# EAGLE design Buttons (EAGLE 8.5.2)
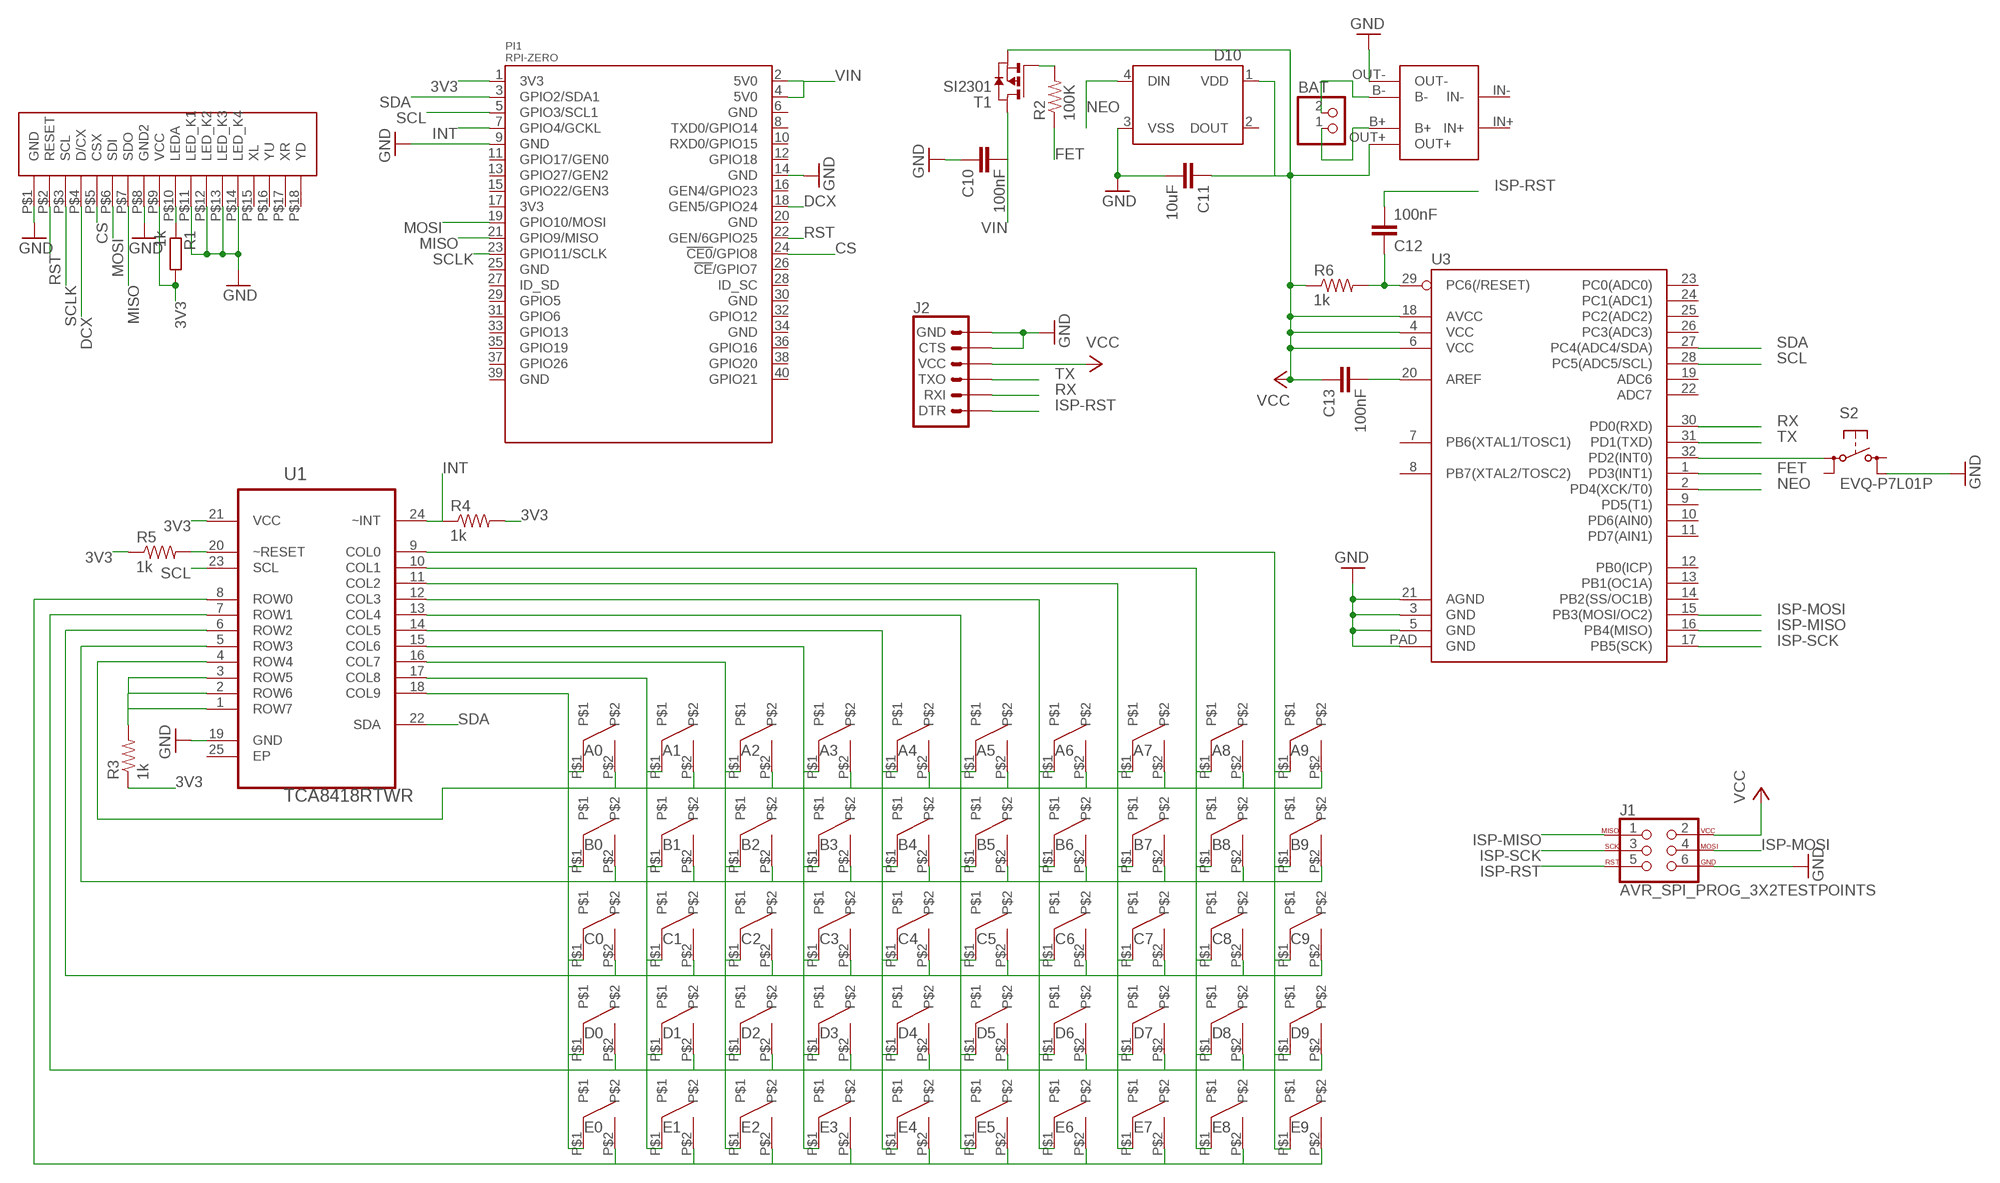
[diagram p0: schematic, sheet 1]

## Parts
A0  5MMSNAP  [5MMSNAP]
A1  5MMSNAP  [5MMSNAP]
A2  5MMSNAP  [5MMSNAP]
A3  5MMSNAP  [5MMSNAP]
A4  5MMSNAP  [5MMSNAP]
A5  5MMSNAP  [5MMSNAP]
A6  5MMSNAP  [5MMSNAP]
A7  5MMSNAP  [5MMSNAP]
A8  5MMSNAP  [5MMSNAP]
A9  5MMSNAP  [5MMSNAP]
B0  5MMSNAP  [5MMSNAP]
B1  5MMSNAP  [5MMSNAP]
B2  5MMSNAP  [5MMSNAP]
B3  5MMSNAP  [5MMSNAP]
B4  5MMSNAP  [5MMSNAP]
B5  5MMSNAP  [5MMSNAP]
B6  5MMSNAP  [5MMSNAP]
B7  5MMSNAP  [5MMSNAP]
B8  5MMSNAP  [5MMSNAP]
B9  5MMSNAP  [5MMSNAP]
BAT  JST_2PIN-SMT-RA  [JST-PH-2-SMT-RA]
C0  5MMSNAP  [5MMSNAP]
C1  5MMSNAP  [5MMSNAP]
C2  5MMSNAP  [5MMSNAP]
C3  5MMSNAP  [5MMSNAP]
C4  5MMSNAP  [5MMSNAP]
C5  5MMSNAP  [5MMSNAP]
C6  5MMSNAP  [5MMSNAP]
C7  5MMSNAP  [5MMSNAP]
C8  5MMSNAP  [5MMSNAP]
C9  5MMSNAP  [5MMSNAP]
C10  100nF  C-EUC0603K  [C0603K]
C11  10uF  C-EUC0603K  [C0603K]
C12  100nF  C-EUC0603K  [C0603K]
C13  100nF  C-EUC0603K  [C0603K]
D0  5MMSNAP  [5MMSNAP]
D1  5MMSNAP  [5MMSNAP]
D2  5MMSNAP  [5MMSNAP]
D3  5MMSNAP  [5MMSNAP]
D4  5MMSNAP  [5MMSNAP]
D5  5MMSNAP  [5MMSNAP]
D6  5MMSNAP  [5MMSNAP]
D7  5MMSNAP  [5MMSNAP]
D8  5MMSNAP  [5MMSNAP]
D9  5MMSNAP  [5MMSNAP]
D10  WS2812B  [WS2812B]
E0  5MMSNAP  [5MMSNAP]
E1  5MMSNAP  [5MMSNAP]
E2  5MMSNAP  [5MMSNAP]
E3  5MMSNAP  [5MMSNAP]
E4  5MMSNAP  [5MMSNAP]
E5  5MMSNAP  [5MMSNAP]
E6  5MMSNAP  [5MMSNAP]
E7  5MMSNAP  [5MMSNAP]
E8  5MMSNAP  [5MMSNAP]
E9  5MMSNAP  [5MMSNAP]
J1  AVR_SPI_PROG_3X2TESTPOINTS  [2X3_TEST_POINTS]
J2  6_PIN_SERIAL_TARGETSILK  [6_PIN_SERIAL_TARGET_SIDE_W_SILK]
PI1  RPI-ZERO  [RASPBERRYPI_BASTELSTUBE_V13_RASPI_BOARD_B+_FULL]
R1  1k  R-EU_R0805  [R0805]
R2  100K  RESISTOR0603-RES  [0603-RES]
R3  1k  RESISTOR0805-RES  [0805]
R4  1k  RESISTOR0805-RES  [0805]
R5  1k  RESISTOR0805-RES  [0805]
R6  1k  RESISTOR0805-RES  [0805]
S2  EVQ-P7L01P  [EVQ-P7L01P]
T1  SI2301  PMOSSOT23  [SOT-23]
U1  TCA8418RTWR  [QFN50P400X400X80-25N]
U3  ATMEGA328P_MLFMLF32  [MLF32-PAD]
U$1  03962A  [03962A]
U$2  ILI9341-2.8  [ILI9341-2.8]

## Nets
3V3: PI1.1(3V3) R1.2 R3.1 R4.2 R5.1 U1.21(VCC) U$2.P$9(VCC)
CS: PI1.24(!CE0!/GPIO8) U$2.P$5(CSX)
DCX: PI1.18(GEN5/GPIO24) U$2.P$4(D/CX)
FET: R2.1 U3.1(PD3(INT1))
GND: C10.1 C11.2 D10.3(VSS) J1.6 J2.P$5(CTS) J2.P$6(GND) PI1.9(GND) PI1.14(GND) S2.B1(S1) U1.19(GND) U3.3(GND) U3.5(GND) U3.21(AGND) U3.PAD(GND) U$1.OUT- U$2.P$1(GND) U$2.P$8(GND2) U$2.P$11(LED_K1) U$2.P$12(LED_K2) U$2.P$13(LED_K3) U$2.P$14(LED_K4)
INT: PI1.7(GPIO4/GCKL) R4.1 U1.24(~INT)
ISP-MISO: J1.1 U3.16(PB4(MISO))
ISP-MOSI: J1.4 U3.15(PB3(MOSI/OC2))
ISP-RST: C12.2 J1.5 J2.P$1(DTR)
ISP-SCK: J1.3 U3.17(PB5(SCK))
MISO: PI1.21(GPIO9/MISO) U$2.P$7(SDO)
MOSI: PI1.19(GPIO10/MOSI) U$2.P$6(SDI)
N$1: S2.A(P) U3.32(PD2(INT0))
N$3: C13.2 U3.20(AREF)
N$4: C12.1 R6.2 U3.29(PC6(/RESET))
N$5: R1.1 U$2.P$10(LEDA)
N$8: R3.2 U1.1(ROW7) U1.2(ROW6) U1.3(ROW5)
N$10: R2.2 T1.3(G)
N$16: R5.2 U1.20(~RESET)
N$23: A9.P$1 B9.P$1 C9.P$1 D9.P$1 E9.P$1 U1.9(COL0)
N$24: A0.P$2 A1.P$2 A2.P$2 A3.P$2 A4.P$2 A5.P$2 A6.P$2 A7.P$2 A8.P$2 A9.P$2 U1.4(ROW4)
N$29: B0.P$2 B1.P$2 B2.P$2 B3.P$2 B4.P$2 B5.P$2 B6.P$2 B7.P$2 B8.P$2 B9.P$2 U1.5(ROW3)
N$30: C0.P$2 C1.P$2 C2.P$2 C3.P$2 C4.P$2 C5.P$2 C6.P$2 C7.P$2 C8.P$2 C9.P$2 U1.6(ROW2)
N$31: D0.P$2 D1.P$2 D2.P$2 D3.P$2 D4.P$2 D5.P$2 D6.P$2 D7.P$2 D8.P$2 D9.P$2 U1.7(ROW1)
N$33: E0.P$2 E1.P$2 E2.P$2 E3.P$2 E4.P$2 E5.P$2 E6.P$2 E7.P$2 E8.P$2 E9.P$2 U1.8(ROW0)
N$36: BAT.1 U$1.B+
N$37: BAT.2 U$1.B-
N$38: A0.P$1 B0.P$1 C0.P$1 D0.P$1 E0.P$1 U1.18(COL9)
N$39: A1.P$1 B1.P$1 C1.P$1 D1.P$1 E1.P$1 U1.17(COL8)
N$40: A2.P$1 B2.P$1 C2.P$1 D2.P$1 E2.P$1 U1.16(COL7)
N$41: A3.P$1 B3.P$1 C3.P$1 D3.P$1 E3.P$1 U1.15(COL6)
N$42: A4.P$1 B4.P$1 C4.P$1 D4.P$1 E4.P$1 U1.14(COL5)
N$43: A5.P$1 B5.P$1 C5.P$1 D5.P$1 E5.P$1 U1.13(COL4)
N$44: A6.P$1 B6.P$1 C6.P$1 D6.P$1 E6.P$1 U1.12(COL3)
N$45: A7.P$1 B7.P$1 C7.P$1 D7.P$1 E7.P$1 U1.11(COL2)
N$46: A8.P$1 B8.P$1 C8.P$1 D8.P$1 E8.P$1 U1.10(COL1)
NEO: D10.4(DIN) U3.2(PD4(XCK/T0))
RST: PI1.22(GEN/6GPIO25) U$2.P$2(RESET)
RX: J2.P$3(RXI) U3.30(PD0(RXD))
SCL: PI1.5(GPIO3/SCL1) U1.23(SCL) U3.28(PC5(ADC5/SCL))
SCLK: PI1.23(GPIO11/SCLK) U$2.P$3(SCL)
SDA: PI1.3(GPIO2/SDA1) U1.22(SDA) U3.27(PC4(ADC4/SDA))
TX: J2.P$2(TXO) U3.31(PD1(TXD))
VCC [Power]: C11.1 C13.1 D10.1(VDD) J1.2 J2.P$4(VCC) R6.1 T1.2(S) U3.4(VCC) U3.6(VCC) U3.18(AVCC) U$1.OUT+
VIN: C10.2 PI1.2(5V0) PI1.4(5V0) T1.1(D)
Unconnected: D10.2(DOUT) PI1.6(GND) PI1.8(TXD0/GPIO14) PI1.10(RXD0/GPIO15) PI1.11(GPIO17/GEN0) PI1.12(GPIO18) PI1.13(GPIO27/GEN2) PI1.15(GPIO22/GEN3) PI1.16(GEN4/GPIO23) PI1.17(3V3) PI1.20(GND) PI1.25(GND) PI1.26(!CE!/GPIO7) PI1.27(ID_SD) PI1.28(ID_SC) PI1.29(GPIO5) PI1.30(GND) PI1.31(GPIO6) PI1.32(GPIO12) PI1.33(GPIO13) PI1.34(GND) PI1.35(GPIO19) PI1.36(GPIO16) PI1.37(GPIO26) PI1.38(GPIO20) PI1.39(GND) PI1.40(GPIO21) S2.A1(P1) S2.B(S) U1.25(EP) U3.7(PB6(XTAL1/TOSC1)) U3.8(PB7(XTAL2/TOSC2)) U3.9(PD5(T1)) U3.10(PD6(AIN0)) U3.11(PD7(AIN1)) U3.12(PB0(ICP)) U3.13(PB1(OC1A)) U3.14(PB2(SS/OC1B)) U3.19(ADC6) U3.22(ADC7) U3.23(PC0(ADC0)) U3.24(PC1(ADC1)) U3.25(PC2(ADC2)) U3.26(PC3(ADC3)) U$1.IN+ U$1.IN- U$2.P$15(XL) U$2.P$16(YU) U$2.P$17(XR) U$2.P$18(YD)

## Library data of the parts
A0 A1-A9 B0 B1-B9 C0 C1-C9 D0 D1-D9 E0 E1-E9 = 5mmSNAP:5MMSNAP
BAT = adafruit:JST_2PIN: JST 2-Pin Connectors of various flavors SMT-RA (S2B-PH-SM4) 4UConnector #17311 SMT (B2B-PH-SM4) THM-RA (S2B-PH) THM (B2B-PH)
C10 C12 C13 = rcl:C-EU: CAPACITOR, European symbol
C11 = resistor:C-EU: CAPACITOR, European symbol
D10 = SparkFun-LED:WS2812B: WS2812B - Intelligent control LED integrated light source Technical Specifications: Power Supply Voltage (VDD): 3.5 to 5.3 V Input Voltage (VI): -0.5 to VDD+0.5 V Operating Junction Temperature (Topt): -25°C to +80°C Storage Temperature Range (Tstg): -55°C to +150°C; PROD_ID: DIO-12503
J1 = SparkFun-Connectors:AVR_SPI_PROG_3X2: AVR ISP 6 Pin This is the reduced ISP connector for AVR programming. Common on Arduino. This footprint will take up less PCB space and can be used with a 10-pin to 6-pin adapter such as SKU: BOB-08508 **Special note about "TEST_POINT" package. The stop mask is on the top side, so if you want your programming test points to be on the bottom of your board, make sure to place this package on the bottom side of the board. This also ensure that the orientation to program from the bottom side will be correct. SparkFun Products: SparkFun ISP Pogo Adapter <https://www.sparkfun.com/products/11591> - NS Tiny AVR Programmer <https://www.sparkfun.com/products/11801> -PTH
J2 = SparkFun-Connectors:6_PIN_SERIAL_TARGET: 6-pin header connection for use with the "FTDI BASIC" pinout - TARGET SIDE. Also known as "Arduino Serial Program Header". It is used to mate with our FTDI Basic serial programmers using the Arduino IDE. Note, this device has "TARGET" in the name. It is intended to be used on a design that contains a target micro-controller that you wish to program. The "sister" device, named "CABLE" is inteneded to be used on a design that usually lives on the end of your USB cable and prvides the converter chip (FTDI232 or FTDI231x) to commnicate serial RX/TX. You can populate with some of these: Break Away Headers - Straight <https://www.sparkfun.com/products/116> (PRT-00116) For reference (or to suit your programming needs) check out these designs: SparkFun FTDI Basic Breakout - 5V <https://www.sparkfun.com/products/9716> (DEV-09716) SparkFun FTDI Basic Breakout - 3.3V <https://www.sparkfun.com/products/9873> (DEV-09873) SparkFun FTDI SmartBasic <https://www.sparkfun.com/products/12935> (DEV-12935) SparkFun Beefy 3 - FTDI Basic Breakout <https://www.sparkfun.com/products/13746> (DEV-13746)
PI1 = RPI-Zero:RPI-ZERO
R1 = resistor:R-EU_: RESISTOR, European symbol
R2-R6 = SparkFun-Passives:RESISTOR: Resistor Basic schematic elements and footprints for 0603, 1206, and PTH resistors.
S2 = switch-panasonic:EVQ-P7L01P: SMD Tactile Switch
T1 = zetex:PMOSSOT23: MOS FET; OC_FARNELL: unknown; OC_NEWARK: unknown
U1 = Texas Instruments_By_element14_Batch_1:TCA8418RTWR: I2C CONTROLLED KEYPAD SCAN IC; MPN: TCA8418RTWR; OC_FARNELL: -; OC_NEWARK: 50R7921; PACKAGE: QFN-24; SUPPLIER: Texas Instruments
U3 = SparkFun-IC-Microcontroller:ATMEGA328P_MLF: Datasheet SparkFun Products () () 32-Pin Atmega328 part Commonly used on Arduino compatible boards Available in QFP and QFN packages TQFP is IC-09069 QFN is non-stock
U$1 = 03962A:03962A
U$2 = ili9341:ILI9341-2.8

## Net classes
0 default: width 0.254 mm, drill 0.356 mm, clearance 0.254 mm
1 Power: width 0.406 mm, drill 0.356 mm, clearance 0.305 mm

## Board
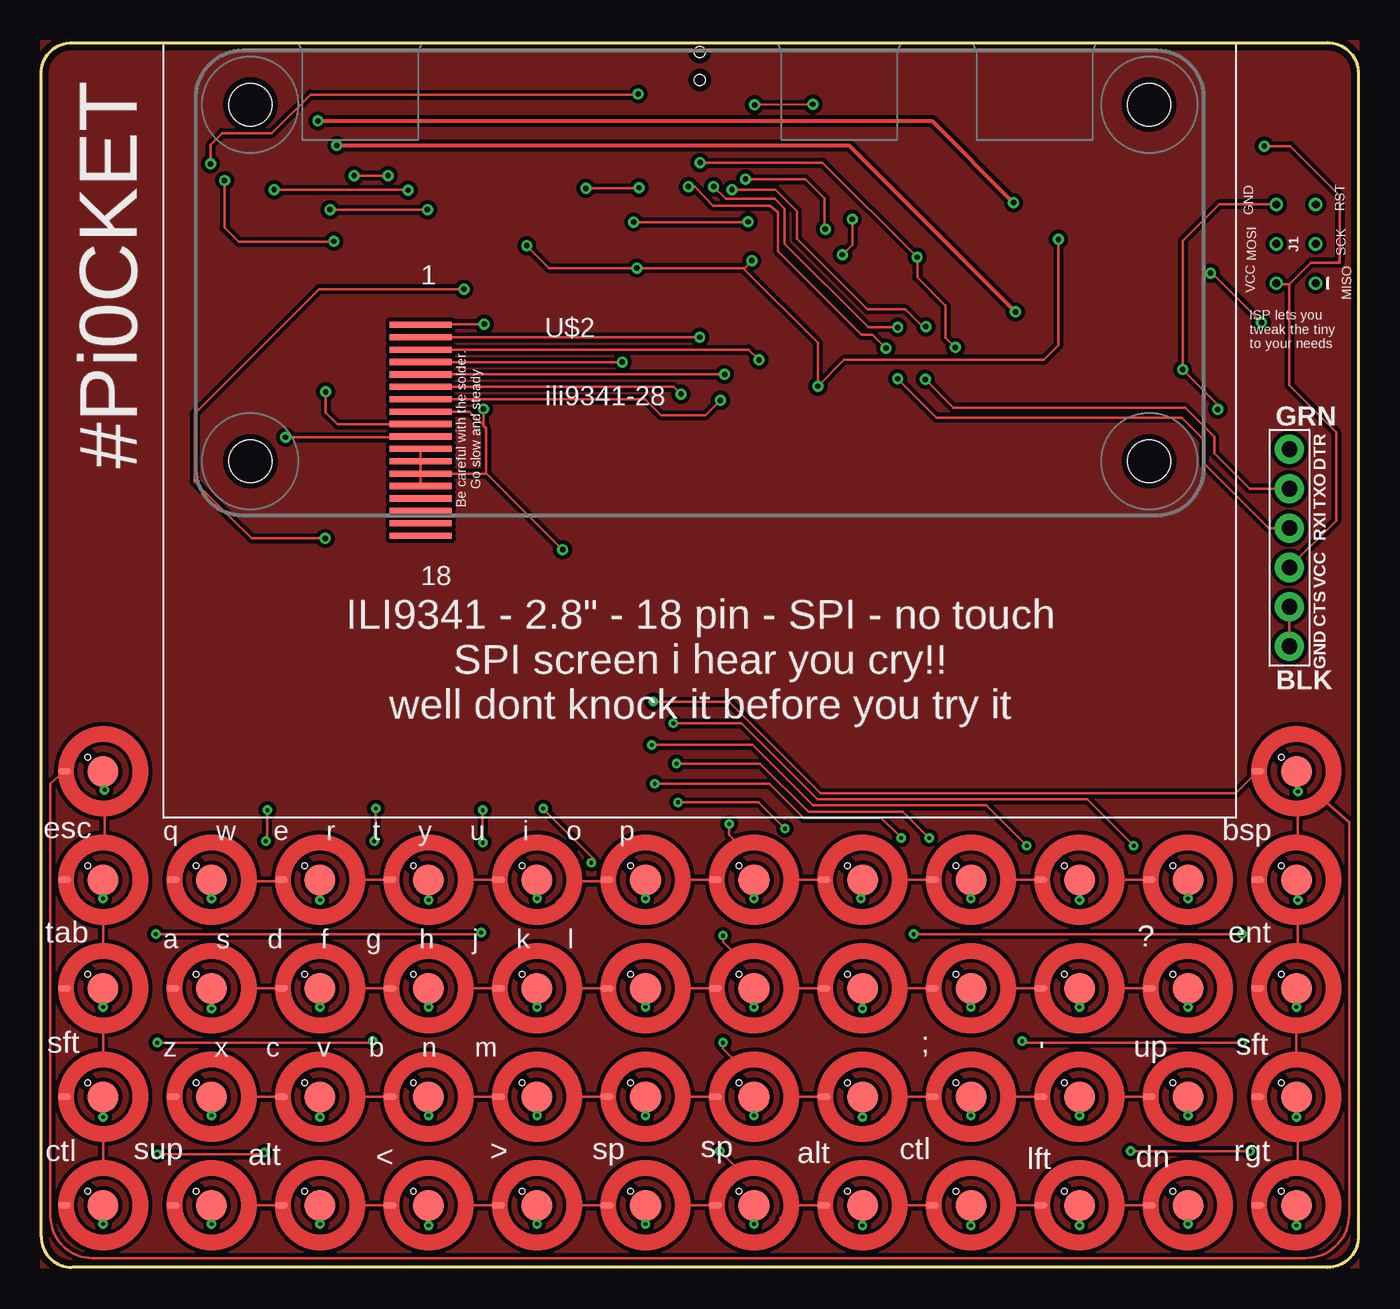
[diagram p1: board, top side]
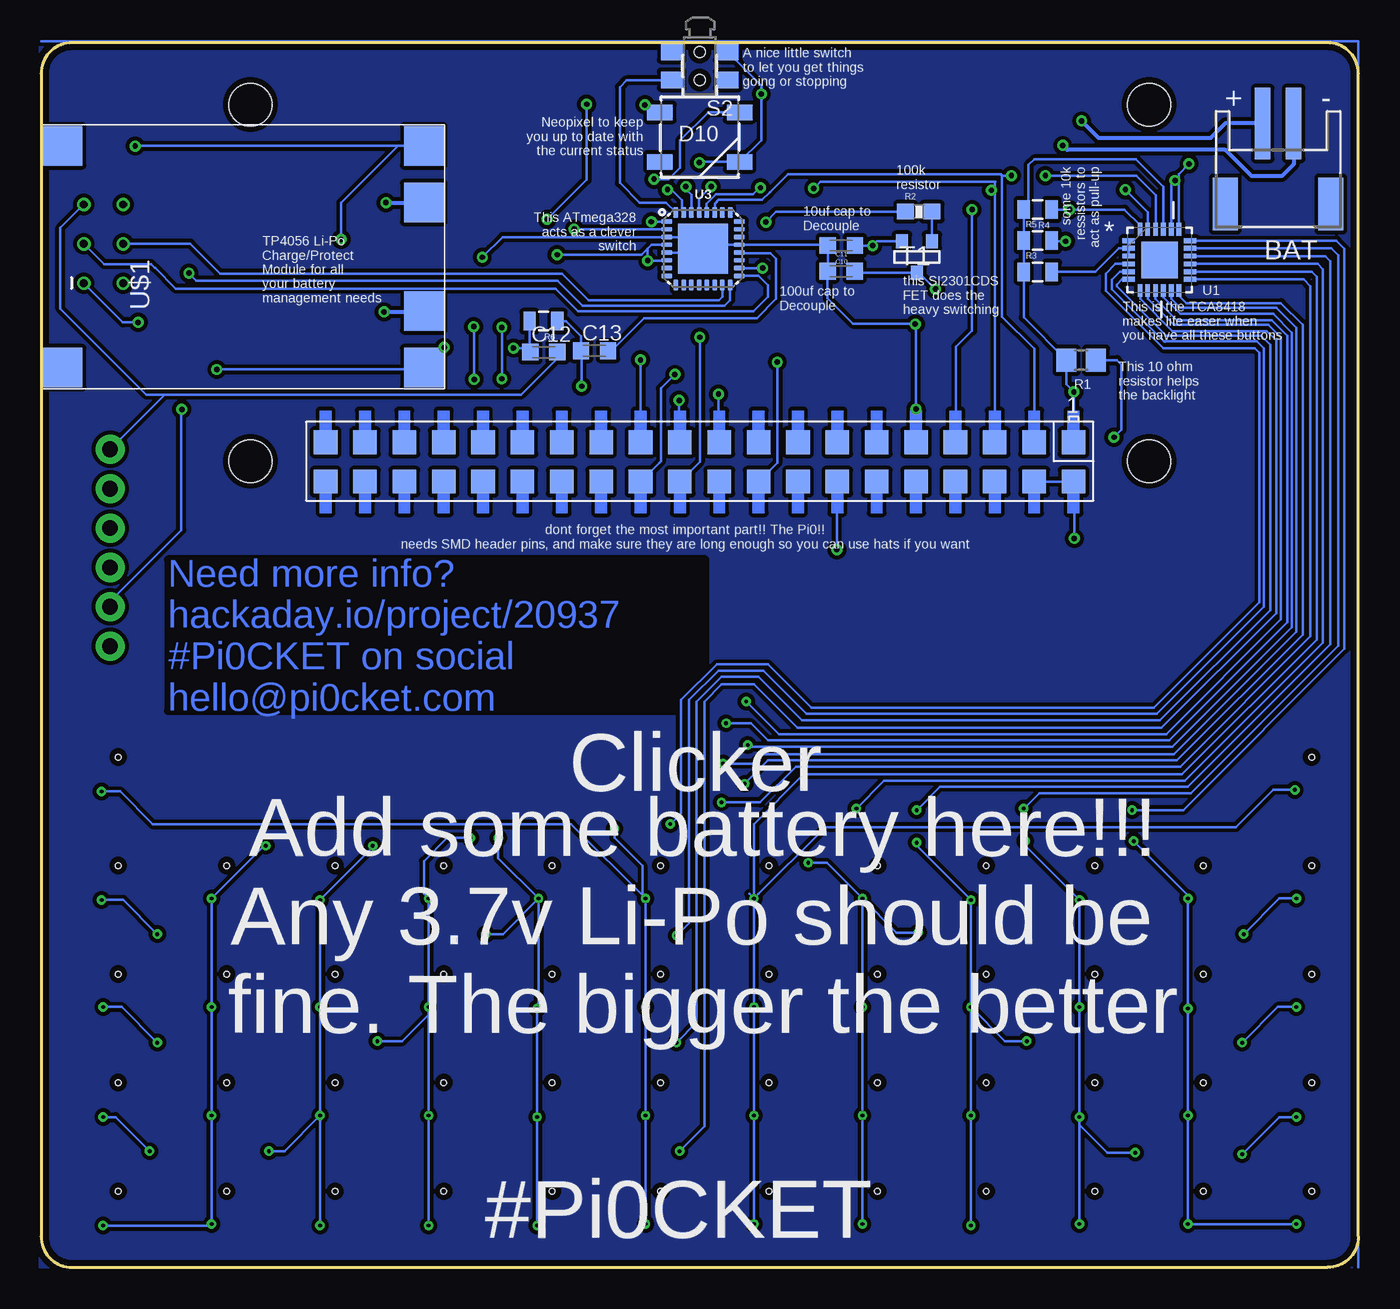
[diagram p2: board, bottom side, seen from below]

Size 85 x 79 mm. Coordinates in mm from the lower left corner, seen from the top.
Outline: 2,79 83,79 arc-90 85,77 85,2 arc-90 83,0 2,0 arc-90 0,2 0,77 arc-90 2,79
Copper layers (1*16): Top 0.0356mm / dielectric 1.5011mm / Bottom 0.0356mm
Design rules "oshpark-2layer *": minimum track width 6mil, minimum drill 13mil, track to track 6mil, track to pad 6mil, pad to pad 6mil, via to via 6mil, smd to smd 6mil, copper to edge 15mil, drill to drill 6mil, minimum pad ring 7mil, minimum via ring 7mil, stop-mask expansion 2.5mil, vias tented up to drill 25mil, thermal gap 10mil

### Footprints (pad centres in the part's own frame; a part is rotated, then mirrored left to right if it is on the bottom)
5MMSNAP = smd 2 x 2: P$1 0,0 | smd 0.813 x 0.406: P$2 -2.5,0 | hole 0.35: -0.98,0.92
JST-PH-2-SMT-RA = smd 1 x 4.6: 1 1,-3.7; 2 -1,-3.7 | smd 1.6 x 3.4: NC1 -3.4,1.5; NC2 3.4,1.5
C0603K = smd 1.05 x 1.08: 1 -0.875,0; 2 0.875,0
WS2812B = smd 1.651 x 1: 1 -2.577,1.6; 2 -2.577,-1.6; 3 2.577,-1.6; 4 2.577,1.6
2X3_TEST_POINTS = drill 0.508: 1 -2.54,-1.27; 2 -2.54,1.27; 3 0,-1.27; 4 0,1.27; 5 2.54,-1.27; 6 2.54,1.27
6_PIN_SERIAL_TARGET_SIDE_W_SILK = drill 1.016 pad 1.88: P$1 -6.35,0; P$2 -3.81,0; P$3 -1.27,0; P$4 1.27,0; P$5 3.81,0; P$6 6.35,0
RASPBERRYPI_BASTELSTUBE_V13_RASPI_BOARD_B+_FULL = smd 1.524 x 1.524: 1 8.382,25.273; 2 8.382,27.813; 3 10.922,25.273; 4 10.922,27.813; 5 13.462,25.273; 6 13.462,27.813; 7 16.002,25.273; 8 16.002,27.813; 9 18.542,25.273; 10 18.542,27.813; 11 21.082,25.273; 12 21.082,27.813; 13 23.622,25.273; 14 23.622,27.813; 15 26.162,25.273; 16 26.162,27.813; 17 28.702,25.273; 18 28.702,27.813; 19 31.242,25.273; 20 31.242,27.813; 21 33.782,25.273; 22 33.782,27.813; 23 36.322,25.273; 24 36.322,27.813; 25 38.862,25.273; 26 38.862,27.813; 27 41.402,25.273; 28 41.402,27.813; 29 43.942,25.273; 30 43.942,27.813; 31 46.482,25.273; 32 46.482,27.813; 33 49.022,25.273; 34 49.022,27.813; 35 51.562,25.273; 36 51.562,27.813; 37 54.102,25.273; 38 54.102,27.813; 39 56.642,25.273; 40 56.642,27.813 | hole 2.75: 3.5,3.5; 3.5,26.5; 61.5,3.5; 61.5,26.5
R0805 = smd 1.3 x 1.5: 1 -0.95,0; 2 0.95,0
0603-RES = smd 1.1 x 1: 1 -0.85,0; 2 0.85,0
0805 = smd 0.8 x 1.2: 1 -0.9,0; 2 0.9,0
EVQ-P7L01P = smd 1.4 x 1.05: A -1.8,-0.9; A1 1.8,-0.9; B -1.8,0.9; B1 1.8,0.9 | hole 0.7: 0,-0.9; 0,0.9
SOT-23 = smd 0.787 x 0.889: 1 0.025,-1.016; 2 -0.94,1.016; 3 0.991,1.016
QFN50P400X400X80-25N = smd 0.813 x 0.305: 1 -1.981,1.245; 2 -1.981,0.762; 3 -1.981,0.254; 4 -1.981,-0.254; 5 -1.981,-0.762; 6 -1.981,-1.245; 13 1.981,-1.245; 14 1.981,-0.762; 15 1.981,-0.254; 16 1.981,0.254; 17 1.981,0.762; 18 1.981,1.245 | smd 0.305 x 0.813: 7 -1.245,-1.981; 8 -0.762,-1.981; 9 -0.254,-1.981; 10 0.254,-1.981; 11 0.762,-1.981; 12 1.245,-1.981; 19 1.245,1.981; 20 0.762,1.981; 21 0.254,1.981; 22 -0.254,1.981; 23 -0.762,1.981; 24 -1.245,1.981 | smd 2.362 x 2.362: 25 0,0
MLF32-PAD = smd 0.7 x 0.3: 1 -2.35,1.75; 2 -2.35,1.25; 3 -2.35,0.75; 4 -2.35,0.25; 5 -2.35,-0.25; 6 -2.35,-0.75; 7 -2.35,-1.25; 8 -2.35,-1.75; 17 2.35,-1.75; 18 2.35,-1.25; 19 2.35,-0.75; 20 2.35,-0.25; 21 2.35,0.25; 22 2.35,0.75; 23 2.35,1.25; 24 2.35,1.75 | smd 0.3 x 0.7: 9 -1.75,-2.35; 10 -1.25,-2.35; 11 -0.75,-2.35; 12 -0.25,-2.35; 13 0.25,-2.35; 14 0.75,-2.35; 15 1.25,-2.35; 16 1.75,-2.35; 25 1.75,2.35; 26 1.25,2.35; 27 0.75,2.35; 28 0.25,2.35; 29 -0.25,2.35; 30 -0.75,2.35; 31 -1.25,2.35; 32 -1.75,2.35 | smd 3.2 x 3.2: PAD 0,0
03962A = smd 2.54 x 2.54: B+ 12,1.35; B- 5,1.35; IN+ 15.65,24.65; IN- 1.35,24.65; OUT+ 15.65,1.35; OUT- 1.35,1.35
ILI9341-2.8 = smd 4 x 0.4: P$1 -18,6.8; P$2 -18,6; P$3 -18,5.2; P$4 -18,4.4; P$5 -18,3.6; P$6 -18,2.8; P$7 -18,2; P$8 -18,1.2; P$9 -18,0.4; P$10 -18,-0.4; P$11 -18,-1.2; P$12 -18,-2; P$13 -18,-2.8; P$14 -18,-3.6; P$15 -18,-4.4; P$16 -18,-5.2; P$17 -18,-6; P$18 -18,-6.8

### Placement (x,y rotation side)
A0  11,25 0 top
A1  18,25 0 top
A2  25,25 0 top
A3  32,25 0 top
A4  39,25 0 top
A5  46,25 0 top
A6  53,25 0 top
A7  60,25 0 top
A8  67,25 0 top
A9  74,25 0 top
B0  11,18 0 top
B1  18,18 0 top
B2  25,18 0 top
B3  32,18 0 top
B4  39,18 0 top
B5  46,18 0 top
B6  53,18 0 top
B7  60,18 0 top
B8  67,18 0 top
B9  74,18 0 top
BAT  5.18,70.09 180 bottom
C0  11,11 0 top
C1  18,11 0 top
C2  25,11 0 top
C3  32,11 0 top
C4  39,11 0 top
C5  46,11 0 top
C6  53,11 0 top
C7  60,11 0 top
C8  67,11 0 top
C9  74,11 0 top
C10  33.37,64.26 0 bottom
C11  33.36,65.92 180 bottom
C12  52.56,59.04 0 bottom
C13  49.29,59.12 0 bottom
D0  11,4 0 top
D1  18,4 0 top
D2  25,4 0 top
D3  32,4 0 top
D4  39,4 0 top
D5  46,4 0 top
D6  53,4 0 top
D7  60,4 0 top
D8  67,4 0 top
D9  74,4 0 top
D10  42.5,72.91 0 bottom
E0  4,4 0 top
E1  4,11 0 top
E2  4,18 0 top
E3  4,25 0 top
E4  4,32 0 top
E5  81,32 0 top
E6  81,25 0 top
E7  81,18 0 top
E8  81,11 0 top
E9  81,4 0 top
J1  80.98,66.02 90 top
J2  80.55,46.42 270 top
PI1  10,78.5 180 bottom
R1  17.88,58.52 180 bottom
R2  28.37,68.1 0 bottom
R3  20.69,64.22 0 bottom
R4  20.7,68.24 180 bottom
R5  20.69,66.24 0 bottom
R6  52.58,61.04 180 bottom
S2  42.5,77.5 0 bottom
T1  28.51,65.18 0 bottom
U1  12.83,64.98 0 bottom
U3  42.29,65.71 0 bottom
U$1  58.96,56.69 90 bottom
U$2  42.5,54 0 top

### Tracks (layer width: path | path; a pad name or v marks a point on that pad's centre or on a via)
3V3  (via drill 0.35)
  Top 0.152: v18.36,56.48 18.36,55.14 19.12,54.38 24.48,54.38 U$2.P$9
  Bottom 0.152: PI1.1 18.36,53.25 v18.36,56.48 18.83,56.95 R1.2 21.59,61.28 R3.1 R5.1 R4.2 21.29,68.55 21.29,71.11 20.92,71.48 14.35,71.48 12.58,69.71 U1.21
CS  (via drill 0.35)
  Top 0.152: U$2.P$5 v44.1,57.6
  Bottom 0.152: v44.1,57.6 45,56.7 45,52 45.1,51.9 | 45.1,51.9 PI1.24 | PI1.24 | PI1.24 45.1,51.9
DCX  (via drill 0.35)
  Top 0.152: U$2.P$4 v37.5,58.4
  Bottom 0.152: v37.5,58.4 37.5,51.89 PI1.18
FET  (via drill 0.35)
  Top 0.152: v38.24,67.43 45.6,67.43 v45.62,67.45
  Bottom 0.152: R2.1 37.57,68.1 v38.24,67.43 | v45.62,67.45 U3.1
GND  (via drill 0.35)
  Top 0.152: U$2.P$14 U$2.P$13 | U$2.P$13 U$2.P$12 U$2.P$11 | 28.75,51.2 U$2.P$13 | 28.75,51.2 v33.65,46.3 | v28.59,60.84 24.54,60.84 U$2.P$1 | U$2.P$8 27.65,55.2 28.7,54.15 28.7,54.11 | 28.7,54.11 28.7,51.25 28.75,51.2 | J2.P$6 J2.P$5 | v75.92,55.35 75.92,55.66 73.68,57.9 | 73.68,57.9 v73.66,57.92 | J1.6 76.01,68.56 73.68,66.23 73.68,57.9 | v58.99,59.34 58.36,59.97 58.36,62.03 56.53,63.86 v56.53,65.16 50.43,71.26 v42.52,71.26 | v10.93,71.18 10.93,72.41 11.68,73.16 14.89,73.16 17.38,75.65 38.49,75.65 v38.53,75.69 | v28.54,55.37 28.54,54.27 28.7,54.11
  Bottom 0.152: v33.65,46.3 33.65,50.66 PI1.14 | 34.23,65.87 C10.1 34.24,62.51 32.62,60.88 28.63,60.88 v28.59,60.84 28.54,60.79 v28.54,55.37 PI1.9 | 34.23,65.87 C11.2 | U3.PAD 43.68,65.71 43.94,65.45 U3.5 | U3.PAD 42.38,65.71 43.11,66.44 44.62,66.44 U3.3 55.23,66.46 v56.53,65.16 | U3.PAD 41.27,65.71 41.01,65.97 U3.21 34.33,65.96 34.23,65.87 | J2.P$5 80.55,42.96 75.96,47.55 75.96,55.31 v75.92,55.35 | v73.66,57.92 60.43,57.92 U$1.OUT- 59.01,59.34 v58.99,59.34 | 38.53,75.8 v38.53,75.69 | v38.53,75.69 38.53,75.6 38.53,72.7 D10.3 42.47,71.31 v42.52,71.26 | U1.19 11.59,70.52 v10.93,71.18 | S2.B1 38.53,76.23 v38.53,75.69
INT  (via drill 0.35)
  Top 0.152: v18.64,68.23 v24.93,68.23
  Bottom 0.152: U1.24 14.08,67.22 15.09,68.23 v18.64,68.23 v18.65,68.24 R4.1 | v24.93,68.23 24.93,60.41 25.96,59.38 25.96,53.27 PI1.7
ISP-MISO  (via drill 0.35)
  Top 0.152: v75.46,64.13 75.57,64.13 v78.74,60.96
  Bottom 0.152: U3.16 40.54,62.39 40.9,62.03 50.05,62.03 51.67,63.65 74.98,63.65 v75.46,64.13 | v78.74,60.96 79.72,60.96 J1.1
ISP-MOSI
  Bottom 0.152: U3.15 41.04,62.6 41.25,62.39 49.69,62.39 51.39,64.09 73.44,64.09 75.38,66.03 79.7,66.03 J1.4
ISP-RST
  Bottom 0.152: C12.2 51.69,58.65 54.03,56.3 77.02,56.3 | 77.02,56.3 J2.P$1 | 77.02,56.3 78.21,56.3 83.75,61.84 83.75,67.06 J1.5
ISP-SCK
  Bottom 0.152: U3.17 38.71,63.96 38.09,63.34 38.09,62.62 39.04,61.67 50.35,61.67 51.82,63.14 76.3,63.14 77.64,64.48 77.67,64.48 77.91,64.72 80.94,64.72 J1.3
MISO  (via drill 0.35)
  Top 0.152: U$2.P$7 38.97,56 39.99,54.98 42.88,54.98 v43.83,55.93
  Bottom 0.152: v43.83,55.93 43.83,53.27 PI1.21
MOSI  (via drill 0.35)
  Top 0.152: U$2.P$6 40.82,56.8 v41.29,56.33
  Bottom 0.152: v41.29,56.33 41.29,53.27 PI1.19
N$1
  Bottom 0.152: S2.A 44.34,76.56 47.24,76.56 47.66,76.14 47.66,69.95 46.4,68.69 44.67,68.69 U3.32
N$3
  Bottom 0.152: C13.2 48.2,59.12 46.08,61.24 38.81,61.24 37.57,62.48 37.57,65.05 37.95,65.43 39.91,65.43 U3.20
N$4  (via drill 0.35)
  Top 0.152: v41.77,69.71 42.2,69.71 43.35,68.49 47.04,68.49 47.55,68.05 47.55,65.55 52.93,60.17 53.65,60.17 v54.52,59.3
  Bottom 0.152: 53.48,59.1 R6.2 | 53.48,59.1 53.48,59.09 C12.1 | U3.29 42.54,68.94 v41.77,69.71 | v54.52,59.3 53.68,59.3 53.48,59.1
N$5  (via drill 0.35)
  Top 0.152: v15.77,53.55 24.45,53.55 U$2.P$10
  Bottom 0.152: R1.1 15.58,58.52 15.29,58.23 15.29,54.03 v15.77,53.55
N$8
  Bottom 0.152: U1.3 U1.2 | U1.1 U1.2 | U1.2 15.45,65.75 16.96,64.23 R3.2
N$9
  Bottom 0.152: 0,0 0,79.1 85,79.1
N$10
  Bottom 0.152: R2.2 T1.3
N$13
  pour Bottom: 0,0 0,79.1 85.1,79.1 85.1,0
N$14
  pour Top: 0,0 0,79.1 85,79.1 85,0
N$16  (via drill 0.35)
  Top 0.152: v11.84,70.11 11.84,67.06 12.75,66.15 18.85,66.15 v18.89,66.19
  Bottom 0.152: U1.20 12.07,69.88 v11.84,70.11 | v18.89,66.19 19.74,66.19 R5.2
N$23  (via drill 0.25)
  Top 0.152: A9.P$1 v74,23.8 | B9.P$1 v74,16.8 | C9.P$1 v74,9.8 | D9.P$1 v74,2.8 | E9.P$1 v81,2.7 | v40.8,35.1 45.2,35.1 50.1,30.2 67.5,30.2 v70.5,27.2
  Bottom 0.152: v81,2.7 74.1,2.7 v74,2.8 v74,9.8 v74,16.8 v74,23.8 70.6,27.2 v70.5,27.2 | U1.9 13.09,62.49 11.7,61.1 5.6,61.1 4.6,60.1 4.6,41.6 12.2,34 38.1,34 39.2,35.1 v40.8,35.1
N$24  (via drill 0.25)
  Top 0.152: A0.P$2 8.5,24.2 9.7,23 10.3,23 10.8,22.5 11.7,22.5 12,22.8 12.1,22.8 13.1,23.8 13.1,24.5 13.5,24.9 15.4,24.9 A1.P$2 15.5,24.3 16.7,23.1 17.1,23.1 17.7,22.5 19.1,22.5 19.5,22.9 19.5,23.3 20,23.8 20,24.5 20.5,25 A2.P$2 22.5,24.3 23.3,23.5 23.4,23.5 24.1,22.8 24.6,22.8 24.9,22.5 25.9,22.5 26.2,22.8 26.2,23 27,23.8 27,24.5 27.5,25 A3.P$2 29.5,24.2 29.8,23.9 30.1,23.9 31.4,22.6 33,22.6 33.3,22.9 33.3,23.6 34.6,24.9 36.4,24.9 A4.P$2 36.5,24.2 37.1,23.6 37.3,23.6 38.1,22.8 39,22.8 39.4,22.4 39.7,22.4 40.7,23.4 40.7,23.6 41.5,24.4 41.5,25 A5.P$2 | A9.P$2 69.3,25 69.3,23.8 69,23.5 68.5,23.5 67.8,22.8 66.5,22.8 66.3,22.6 66,22.6 65.4,23.2 65.4,23.7 64.7,24.4 64.7,24.8 A8.P$2 62.8,25 62.3,24.5 62.3,24 62,23.7 61.8,23.7 61.3,23.2 60.8,23.2 60.4,22.8 58.8,22.8 58.6,23 58.6,23.1 57.7,24 57.7,24.8 A7.P$2 55.5,25 55.3,24.8 55.3,24 55.1,23.8 55,23.8 54.4,23.2 54.2,23.2 53.8,22.8 52.4,22.8 52.3,22.7 51.7,22.7 51,23.4 51,24.5 A6.P$2 48.3,25 48.3,24.4 48,24.1 48,23.8 47.4,23.2 47.3,23.2 46.9,22.8 44.8,22.8 44.4,23.2 44.3,23.2 43.7,23.8 43.7,24.8 A5.P$2 | v44.4,28.6 44.4,27.9 45.1,27.2 44.8,27.2 44.5,26.9 44.3,26.9 43.8,26.4 43.8,25.3 A5.P$2
  Bottom 0.152: v44.4,28.6 43.7,29.3 43.7,36.6 41.4,38.9 38.1,38.9 35.3,36.1 13.2,36.1 6.4,42.9 6.4,59 6.7,59.3 12.6,59.3 16.3,63 16.3,64.1 15.67,64.73 U1.4
N$29  (via drill 0.25)
  Top 0.152: B0.P$2 8.5,17.1 9,16.6 9.1,16.6 10,15.7 11.1,15.7 11.3,15.5 11.7,15.5 12.5,16.3 12.5,16.7 13.1,17.3 13.1,17.8 13.3,18 B1.P$2 15.5,17.2 16.2,16.5 16.4,16.5 17.3,15.6 18.7,15.6 18.9,15.4 18.9,15.6 19.6,16.3 19.6,16.7 20.1,17.2 20.1,17.7 20.4,18 B2.P$2 22.5,17.3 23.1,16.7 23.3,16.7 24.3,15.7 25.1,15.7 25.2,15.6 25.8,15.6 26.4,16.2 26.4,16.4 27.3,17.3 27.3,17.8 27.5,18 B3.P$2 29.5,17.4 31,15.9 32.8,15.9 32.9,15.8 33,15.8 34.3,17.1 34.3,17.9 34.4,18 B4.P$2 36.5,17.3 37,16.8 37,16.7 37.9,15.8 39,15.8 39.3,15.5 39.7,15.5 40.8,16.6 40.8,17.1 41.3,17.6 41.3,17.9 41.4,18 B5.P$2 | B5.P$2 43.5,17.3 44.1,16.7 44.1,16.6 44.6,16.1 45.2,16.1 45.5,15.8 46.8,15.8 46.9,15.7 47.1,15.7 47.9,16.5 47.9,17 48.5,17.6 48.5,17.9 48.4,18 B6.P$2 50.5,17.1 51.2,16.4 51.4,16.4 52,15.8 53.1,15.8 53.3,15.6 53.8,15.6 54.3,16.1 54.3,16.2 55.2,17.1 55.2,17.9 55.3,18 B7.P$2 57.5,17.4 58.2,16.7 58.2,16.5 58.8,15.9 60,15.9 60.2,15.7 60.9,15.7 61.8,16.6 61.8,17.2 62.6,18 B8.P$2 64.5,17.3 65.2,16.6 65.2,16.4 65.6,16 67,16 67.4,15.6 67.7,15.6 68.8,16.7 68.8,17.2 69.6,18 B9.P$2 | v44,21.4 44,21 44.9,20.1 44.6,20.1 44.1,19.6 44.1,19 43.7,18.6 43.7,18.2 B5.P$2
  Bottom 0.152: v44,21.4 43.2,22.2 43.2,36.6 41.3,38.5 39,38.5 38.4,38.5 35.6,35.7 13,35.7 6.1,42.6 6.1,59.3 6.55,59.75 12.55,59.75 | U1.5 15.38,64.22 15.9,63.7 15.9,63.1 12.55,59.75 | 12.55,59.75 12.5,59.7
N$30  (via drill 0.25)
  Top 0.152: C0.P$2 8.5,10 8.8,9.7 9,9.7 9.7,9 12.3,9 12.5,9.2 12.5,9.7 13.2,10.4 13.2,10.8 13.4,11 C1.P$2 15.5,10.1 15.9,9.7 16.1,9.7 17.2,8.6 18.7,8.6 20,9.9 20,10.7 20.3,11 C2.P$2 22.5,10.2 23,9.7 23.3,9.7 24.2,8.8 25.1,8.8 25.4,8.5 25.9,8.5 26.6,9.2 26.6,9.8 27.3,10.5 27.3,10.8 27.5,11 C3.P$2 29.5,10.3 30,9.8 30.2,9.8 31,9 31.6,9 32.1,8.5 32.8,8.5 33.5,9.2 33.5,9.4 34.3,10.2 34.3,10.9 34.2,11 C4.P$2 36.5,10.2 37.8,8.9 38.8,8.9 39,8.7 39.8,8.7 40.1,9 40.1,9.2 40.8,9.9 40.8,10.3 41.5,11 C5.P$2 | C9.P$2 69.6,11 69.5,10.9 69.5,10.3 68.9,9.7 68.7,9.7 68.1,9.1 67.7,9.1 67.2,8.6 65.9,8.6 65.6,8.9 65.6,9.3 64.8,10.1 64.8,10.7 C8.P$2 62.4,11 62.4,10.2 62.2,10 62.2,9.7 61.7,9.2 61.1,9.2 60.8,8.9 60.4,8.9 60.1,8.6 58.9,8.6 58.2,9.3 58.2,9.8 57.8,10.2 57.8,10.7 C7.P$2 55.4,11 55.4,10.2 54.9,9.7 54.4,9.7 53.4,8.7 51.8,8.7 51.1,9.4 51.1,9.9 50.6,10.4 50.6,10.9 C6.P$2 48.6,11 48.5,10.9 48.5,10.4 48.1,10 48,10 47.4,9.4 47.1,9.4 46.5,8.8 44.7,8.8 44.5,9 44.5,9.3 43.8,10 43.8,10.7 C5.P$2 | v44,14.5 44,14.1 44.9,13.2 44.5,13.2 44,12.7 44,12.4 43.7,12.1 43.7,11.2 C5.P$2
  Bottom 0.152: v44,14.5 42.7,15.8 42.7,36.5 41.1,38.1 38.7,38.1 35.9,35.3 12.8,35.3 5.7,42.4 5.7,59.5 6.3,60.1 12.4,60.1 15.6,63.3 15.6,63.4 15.26,63.74 U1.6
N$31  (via drill 0.25)
  Top 0.152: D0.P$2 8.5,3.2 8.8,2.9 8.8,2.7 9.5,2 10.7,2 11.1,1.6 12.1,1.6 12.8,2.3 12.8,3.3 13.5,4 D1.P$2 15.5,3.2 16.2,2.5 16.5,2.5 17.4,1.6 18.6,1.6 18.8,1.8 18.9,1.8 20.1,3 20.1,3.7 20.4,4 D2.P$2 22.5,3.5 23.1,2.9 23.1,2.3 23.6,1.8 24.9,1.8 25.1,1.6 25.6,1.6 26.2,2.2 26.3,2.2 27,2.9 27,3.5 27.5,4 D3.P$2 29.5,3.5 30.2,2.8 30.2,2.6 30.7,2.1 31,2.1 31.5,1.6 32,1.6 32.2,1.4 32.6,1.4 34,2.8 34,3.6 34.4,4 D4.P$2 36.5,3.1 36.8,2.8 37,2.8 38.1,1.7 38.9,1.7 39.1,1.5 40.1,1.5 40.4,1.8 40.4,2.1 41,2.7 41,3 41.5,3.5 41.5,3.9 41.4,4 D5.P$2 | D5.P$2 43.5,3.3 44.1,2.7 44.2,2.7 44.9,2 45.8,2 46.2,1.6 46.9,1.6 47.7,2.4 47.7,3.2 48.5,4 D6.P$2 50.5,3.3 50.7,3.1 50.7,2.9 51.4,2.2 52,2.2 52.4,1.8 53.5,1.8 53.7,1.6 53.9,1.6 54.5,2.2 54.5,2.5 55.2,3.2 55.2,3.9 55.3,4 D7.P$2 57.5,3.1 57.7,2.9 57.8,2.9 58.6,2.1 59.4,2.1 60,1.5 61,1.5 61.3,1.8 61.3,2.3 62,3 62,3.5 62.5,4 D8.P$2 64.5,3.2 64.7,3 64.8,3 65.9,1.9 66.9,1.9 67.3,1.5 67.7,1.5 68.6,2.4 68.6,2.5 69.2,3.1 69.2,3.7 69.5,4 D9.P$2 | v43.8,7.5 44.9,6.4 44.9,6.3 44.2,5.6 44.2,5.2 43.7,4.7 43.7,4.2 D5.P$2
  Bottom 0.152: v43.8,7.5 42.2,9.1 42.2,36.5 41.1,37.6 39,37.6 36.2,34.8 12.7,34.8 5.3,42.2 5.3,59.8 5.9,60.4 12,60.4 14.08,62.48 U1.7
N$33  (via drill 0.25)
  Top 0.152: E9.P$2 78.5,4.9 79.4,5.8 80.4,5.8 81.1,6.5 81.1,8.4 80.9,8.6 80,8.6 79.8,8.8 79.8,9 78.7,10.1 78.7,10.8 E8.P$2 78.5,12 79.3,12.8 79.8,12.8 80.5,13.5 81,13.5 81,15.5 80.8,15.7 80.1,15.7 79.8,16 79.6,16 79,16.6 79,17.5 E7.P$2 78.5,18.8 79.9,20.2 80.9,20.2 81.1,20.4 81.1,22.5 81,22.6 79.9,22.6 79.3,23.2 79.3,23.5 78.7,24.1 78.7,24.8 E6.P$2 78.5,26.1 79.1,26.7 79.3,26.7 79.9,27.3 81,27.3 81.1,27.4 81.1,29.6 80.2,29.6 79.4,30.4 79.4,30.5 78.8,31.1 78.8,31.7 E5.P$2 | E0.P$2 1.5,5 2.3,5.8 2.5,5.8 3,6.3 3.9,6.3 4,6.4 4,8.3 3.8,8.5 3.2,8.5 2.4,9.3 2.2,9.3 1.5,10 E1.P$2 1.5,11.8 2,12.3 2,12.4 2.6,13 3.6,13 4,13.4 4,15.6 3.9,15.7 2.8,15.7 2.6,15.9 2.5,15.9 1.6,16.8 1.6,17.9 E2.P$2 1.5,18.6 2,19.1 2,19.5 2.5,20 3.1,20 3.5,20.4 3.9,20.4 4,20.5 4,22.5 3.5,22.5 3.1,22.9 2.7,22.9 2.1,23.5 2.1,23.7 1.5,24.3 E3.P$2 1.5,25.9 2.2,26.6 2.4,26.6 3.1,27.3 3.9,27.3 4.1,27.5 4.1,29.7 4,29.8 2.7,29.8 2.2,30.3 2.2,31.3 E4.P$2 0.6,31.2 0.6,3.4 0.6,3.3 arc90 3.3,0.6 81.6,0.6 arc90 84.4,3.4 84.4,28.7 82.7,30.2 82.6,30.2 81.9,29.5 81.5,29.5 81.4,29.6 80.1,29.6 78.5,31.2 E5.P$2 | E5.P$2 78.3,31.8 77.1,30.6 50.3,30.6 44.4,36.5 v39.5,36.5
  Bottom 0.152: U1.8 13.6,62.5 11.9,60.8 5.8,60.8 5,60 5,41.8 12.4,34.4 37.4,34.4 v39.5,36.5
N$36  (via drill 0.35)
  Top 0.254: v17.86,73.95 57.48,73.95 v62.75,68.68
  Bottom 0.254: BAT.1 8.59,73.79 9.54,72.84 16.75,72.84 v17.86,73.95 | v62.75,68.68 U$1.B+
N$37  (via drill 0.35)
  Top 0.254: v19.08,72.37 52.13,72.37 v62.87,61.63
  Bottom 0.254: BAT.2 4.18,71.16 4.95,70.39 6.89,70.39 8.59,72.09 18.8,72.09 v19.08,72.37 | v62.87,61.63 60.37,61.63 U$1.B-
N$38  (via drill 0.25)
  Top 0.152: A0.P$1 v11,23.8 | B0.P$1 v11,16.7 | C0.P$1 v11,9.8 | D0.P$1 v11,2.8 | E0.P$1 v4,2.8 | v14.5,27.5 14.6,27.5 v14.6,29.5
  Bottom 0.152: v4,2.8 v11,2.8 v11,9.8 v11,16.7 v11,23.8 11,24 v14.5,27.5 | U1.18 1.43,66.23 0.9,65.7 0.9,39.9 11.3,29.5 v14.6,29.5
N$39  (via drill 0.25)
  Top 0.152: A1.P$1 v18,23.7 | B1.P$1 v18,16.8 | C1.P$1 v18,9.7 | D1.P$1 v18,2.8 | E1.P$1 v4,9.7 | v7.5,7.3 14.3,7.3 v14.4,7.4 | v21.6,29.6 21.6,28.6 v21.5,27.5
  Bottom 0.152: 18,9.2 v18,9.7 v18,16.8 v18,23.7 21.5,27.2 v21.5,27.5 | 18,9.2 v18,2.8 | v4,9.7 5.1,9.7 v7.5,7.3 | v14.4,7.4 16.2,7.4 18,9.2 | U1.17 1.75,65.75 1.3,65.3 1.3,40.1 10.8,30.6 20.6,30.6 v21.6,29.6
N$40  (via drill 0.25)
  Top 0.152: A2.P$1 v25,23.7 | B2.P$1 v25,16.8 | C2.P$1 v25,9.8 | D2.P$1 v25,2.7 | E2.P$1 v4,16.8 | v7.5,14.5 21.3,14.5 v21.4,14.6 | v28.5,29.5 v28.5,27.4
  Bottom 0.152: v25,2.7 v25,9.8 v25,16.8 | v25,16.8 v25,23.7 28.5,27.2 v28.5,27.4 | v4,16.8 5.2,16.8 v7.5,14.5 | v21.4,14.6 22.8,14.6 v25,16.8 | U1.16 2.14,65.24 1.8,64.9 1.8,40.2 11,31 27,31 v28.5,29.5
N$41  (via drill 0.25)
  Top 0.152: A3.P$1 v32,23.8 | B3.P$1 v32,16.8 | C3.P$1 v32,9.8 | D3.P$1 v32,2.8 | E3.P$1 v4,23.8 | v7.4,21.5 28.3,21.5 v28.4,21.6 | v32.4,29.6 35.7,26.3 v35.5,26.1
  Bottom 0.152: v32,2.8 v32,9.8 v32,16.8 v32,23.8 | v4,23.8 5.1,23.8 v7.4,21.5 | v28.4,21.6 29.8,21.6 v32,23.8 | v35.5,26.1 34.3,26.1 v32,23.8 | U1.15 2.63,64.73 2.3,64.4 2.3,40.3 11.2,31.4 30.6,31.4 v32.4,29.6
N$42  (via drill 0.25)
  Top 0.152: A4.P$1 v39,23.8 | B4.P$1 v39,16.8 | C4.P$1 v39,9.8 | D4.P$1 v39,2.8 | E4.P$1 4,30.9 v4.1,30.8
  Bottom 0.152: v39,9.8 v39,2.8 | v39,16.8 v39,9.8 | v39,16.8 39,10 39.2,9.8 v39,9.8 | v39,16.8 v39,23.8 | v4.1,30.8 5.5,30.8 7.9,28.4 34.4,28.4 v39,23.8 | 38.7,24.1 v39,23.8 | 39.3,24.1 v39,23.8 | v39,23.8 39,28.6 35.8,31.8 11.4,31.8 2.7,40.5 2.7,63.9 3.02,64.22 U1.14
N$43  (via drill 0.25)
  Top 0.152: A5.P$1 v46,23.8 | B5.P$1 v46,16.8 | C5.P$1 v46,9.8 | D5.P$1 v46,2.8 | E5.P$1 81,30.8 v81.1,30.7 | v41.1,30 46.3,30 v48,28.3
  Bottom 0.152: v46,2.8 v46,9.8 v46,16.8 v46,23.8 | v81.1,30.7 79.9,30.7 77.8,28.6 50.8,28.6 v46,23.8 | v48,28.3 48,27.7 46.2,25.9 46.2,24 v46,23.8 | U1.13 3.54,63.74 3.1,63.3 3.1,40.7 11.5,32.3 36.3,32.3 38.6,30 v41.1,30
N$44  (via drill 0.25)
  Top 0.152: A6.P$1 53,23.9 v52.9,23.8 | B6.P$1 v53,16.7 | C6.P$1 v53,9.7 | D6.P$1 v53,2.7 | E6.P$1 81,23.8 v81.1,23.7 | v77.5,21.5 v56.3,21.5 | v39.6,31.2 47,31.2 49.2,29 54.2,29 v55.5,27.7
  Bottom 0.152: v52.9,23.8 52.9,16.8 v53,16.7 v53,9.7 v53,2.7 | v81.1,23.7 79.7,23.7 v77.5,21.5 | v56.3,21.5 55.2,21.5 v52.9,23.8 | v55.5,27.7 55.5,26.4 v52.9,23.8 | U1.12 11.59,62.69 11.1,62.2 5,62.2 3.6,60.8 3.6,40.8 11.7,32.7 38.1,32.7 v39.6,31.2
N$45  (via drill 0.25)
  Top 0.152: A7.P$1 v60,23.8 | B7.P$1 v60,16.8 | C7.P$1 v60,9.8 | D7.P$1 v60,2.7 | E7.P$1 v81,16.8 | v77.5,14.5 63.4,14.5 v63.3,14.6 | v41,32.5 46.4,32.5 49.5,29.4 55.6,29.4 v57.3,27.7
  Bottom 0.152: v60,2.7 v60,9.8 60,16.3 | 60,16.3 v60,16.8 v60,23.8 60.3,24.1 60.3,26.2 58.8,27.7 v57.3,27.7 | v81,16.8 79.8,16.8 v77.5,14.5 | v63.3,14.6 61.7,14.6 60,16.3 | U1.11 12.07,62.47 11.5,61.9 5.3,61.9 4,60.6 4,41 11.9,33.1 38.5,33.1 39.1,32.5 v41,32.5
N$46  (via drill 0.25)
  Top 0.152: v67,23.7 A8.P$1 | B8.P$1 v67,16.8 | C8.P$1 v67,9.8 | D8.P$1 v67,2.7 | E8.P$1 v81,9.7 | v78,7.5 v70.3,7.5 | v39.4,33.7 45.9,33.7 49.8,29.8 61,29.8 v63.6,27.2
  Bottom 0.152: v67,9.8 v67,2.7 | v67,9.8 v67,16.8 v67,23.7 63.6,27.1 v63.6,27.2 | v81,9.7 80.2,9.7 v78,7.5 | v70.3,7.5 69.3,7.5 v67,9.8 | U1.10 12.58,62.58 11.5,61.5 5.5,61.5 4.3,60.3 4.3,41.3 12,33.6 39.3,33.6 v39.4,33.7
NEO  (via drill 0.35)
  Top 0.152: v45.45,70.2 49.31,70.2 50.56,68.95 50.56,67.01 v50.6,66.97
  Bottom 0.152: D10.4 41.95,74.51 43.77,72.69 43.77,70.93 44.5,70.2 v45.45,70.2 | v50.6,66.97 U3.2
RST  (via drill 0.35)
  Top 0.152: U$2.P$2 v42.5,60
  Bottom 0.152: v42.5,60 42.5,51.97 PI1.22
RX  (via drill 0.35)
  Top 0.152: J2.P$3 79.22,47.69 75.06,51.85 75.06,53.36 73.6,54.82 57.77,54.82 v55.27,57.32 | v55.27,60.64 53.37,60.64 47.98,66.03 47.98,68.29 47.35,68.92 44.18,68.92 v43.39,69.71
  Bottom 0.152: v55.27,57.32 v55.27,60.64 | v43.39,69.71 43.39,69.56 43.03,69.2 U3.30
SCL  (via drill 0.35)
  Top 0.152: v15.04,69.52 23.64,69.52 v23.68,69.48 | v35.15,69.6 38.54,69.6 v38.58,69.64
  Bottom 0.152: 23.46,69.52 PI1.5 | 23.46,69.52 23.46,70.01 23.43,70.04 34.71,70.04 v35.15,69.6 | U1.23 13.6,68.08 v15.04,69.52 | v23.68,69.48 23.5,69.48 23.46,69.52 | v38.58,69.64 38.63,69.64 39.06,69.21 41.44,69.21 42.05,68.6 U3.28
SCLK  (via drill 0.35)
  Top 0.152: U$2.P$3 45.66,59.2 v46.32,58.54
  Bottom 0.152: v46.32,58.54 PI1.23
SDA  (via drill 0.35)
  Top 0.152: v22.39,70.43 v20.21,70.43 v20.2,70.42
  Bottom 0.152: PI1.3 20.92,59.25 23,61.33 23,70.43 | 23,70.43 23.08,70.51 36.81,70.51 37.96,69.36 37.98,69.36 38.47,68.87 41.28,68.87 41.53,68.62 U3.27 | 23,70.43 v22.39,70.43 | v20.2,70.42 14.33,70.42 13.08,69.17 13.08,66.97 U1.22
TX  (via drill 0.35)
  Top 0.152: J2.P$2 77.99,50.23 75.7,52.52 75.7,53.59 73.84,55.45 58.88,55.45 v57.05,57.28 | v57.09,60.68 56.89,60.68 55.78,61.79 53.33,61.79 48.77,66.35 48.77,68.14 47.39,69.52 v44.58,69.52
  Bottom 0.152: v57.05,57.28 57.05,60.64 v57.09,60.68 | v44.58,69.52 44.31,69.52 43.63,68.84 43.63,68.15 U3.31
VCC  (via drill 0.35)
  Top 0.152: v31.34,65.91 32.79,64.46 v38.44,64.46 45.29,64.46 | 45.29,64.46 45.38,64.46 v45.86,64.94 | v78.93,72.33 80.59,72.33 83.79,69.13 83.79,64.96 83.72,64.89 83.72,64.88 83.79,64.81 81.94,64.81 80.55,63.42 | 80.55,63.42 79.77,63.42 J1.2 | 80.55,63.42 80.55,56.89 83.56,53.88 83.56,48.16 J2.P$4 | v65.64,66.31 65.64,59.49 64.69,58.54 51.82,58.54 v50.12,56.84 50.12,59.63 45.29,64.46 | v46.04,74.99 v49.8,75.03 | v52.34,67.61 52.34,65.96 v51.7,65.32
  Bottom 0.152: R6.1 51.14,61.04 50.17,60.07 C13.1 50.12,59.08 v50.12,56.84 | U3.18 v38.44,64.46 | C11.1 v31.34,65.91 31.05,66.2 T1.2 | U3.6 44.66,64.94 v45.86,64.94 45.86,65.71 | U3.4 45.61,65.96 45.86,65.71 | v78.93,72.33 v78.92,72.34 U$1.OUT+ 61.98,72.34 65.64,68.68 v65.64,66.31 | D10.1 45.08,74.64 v46.04,74.99 | v49.8,75.03 49.8,70.15 v52.34,67.61 | v51.7,65.32 46.25,65.32 45.86,65.71
VIN  (via drill 0.35)
  Top 0.152: v27.28,63.1 17.94,63.1 9.9,55.06 9.9,50.69 12.23,48.36 12.24,48.36 13.58,47.02 v18.33,47.02
  Bottom 0.152: PI1.4 PI1.2 18.33,50.63 v18.33,47.02 | C10.2 32.4,64.16 T1.1 28.34,64.16 v27.28,63.1

### Text on the board
Bottom: Need more info? / hackaday.io/project/20937 / #Pi0CKET on social / hello@pi0cket.com
tPlace: GND | RST | MOSI | SCK | VCC | MISO | ISP lets you / tweak the tiny / to your needs | Be careful with the solder. / Go slow and steady | #Pi0CKET | ILI9341 - 2.8" - 18 pin - SPI - no touch / SPI screen i hear you cry!! / well dont knock it before you try it | esc | q w e r t y u i o p | bsp | tab | a s d f g h j k l | ? | ent | sft | z x c v b n m | ; | up | sft | ' | ctl | sup | alt | > | sp | sp | alt | ctl | rgt | < | lft | dn
bPlace: A nice little switch / to let you get things / going or stopping | Neopixel to keep / you up to date with / the current status | some 10k / ressistors to / act as pull-up | 100k / resistor | 10uf cap to / Decouple | This ATmega328 / acts as a clever / switch | 100uf cap to / Decouple | TP4056 Li-Po / Charge/Protect / Module for all / your battery / management needs | this SI2301CDS / FET does the / heavy switching | This is the TCA8418 / makes life easer when / you have all these buttons | This 10 ohm / resistor helps / the backlight | dont forget the most important part!! The Pi0!! / needs SMD header pins, and make sure they are long enough so you can use hats if you want | Clicker | Add some battery here!!! / Any 3.7v Li-Po should be / fine. The bigger the better | #Pi0CKET